# EAGLE schematic base_robot (EAGLE 9.6.2)
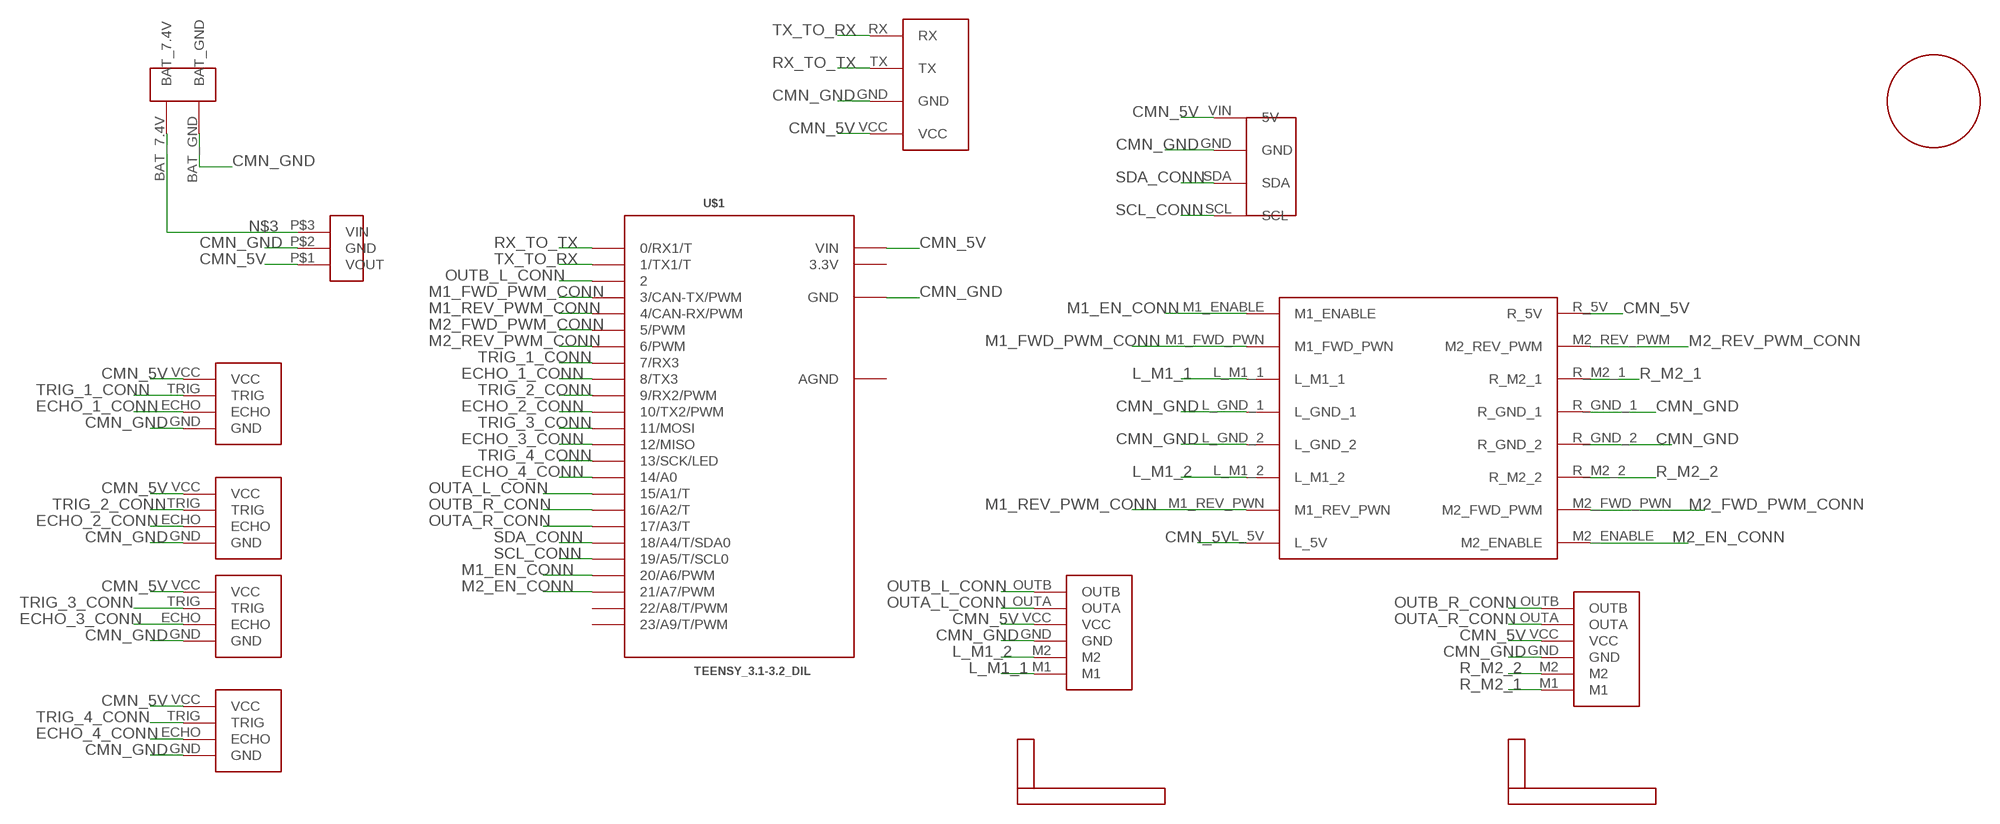
[diagram p0: schematic, sheet 1]

## Parts
U$1  TEENSY_3.1-3.2_DIL  [TEENSY_3.0-3.2&LC_DIL]
U$2  MOTOR_DRIVER  [MOTOR_DRIVER]
U$3  VOLTAGE_REGULATOR  [VOLTAGE_REGULATOR]
U$4  SONAR_SENSOR  [SONAR_SENSOR]
U$5  SONAR_SENSOR  [SONAR_SENSOR]
U$6  SONAR_SENSOR  [SONAR_SENSOR]
U$7  SONAR_SENSOR  [SONAR_SENSOR]
U$8  BATTERY_INPUT  [BATTERY_INPUT]
U$9  MOTOR_ENCODER_25D  [MOTOR_ENCODER_25D]
U$10  MOTOR_ENCODER_25D  [MOTOR_ENCODER_25D]
U$11  IMU  [IMU]
U$12  HC05_BLUETOOTH  [HC05_BLUETOOTH]
U$13  3_4_BALLCASTER  [3_4_BALLCASTER]
U$14  MOTOR_BRACKET_25D  [MOTOR_BRACKET_25D]
U$15  MOTOR_BRACKET_25D  [MOTOR_BRACKET_25D]

## Nets
CMN_5V: U$1.VIN U$2.L_5V U$2.R_5V U$3.P$1(VOUT) U$4.VCC U$5.VCC U$6.VCC U$7.VCC U$9.VCC U$10.VCC U$11.VIN(5V) U$12.VCC
CMN_GND: U$1.GND U$2.L_GND_1 U$2.L_GND_2 U$2.R_GND_1 U$2.R_GND_2 U$3.P$2(GND) U$4.GND U$5.GND U$6.GND U$7.GND U$8.BAT_GND U$9.GND U$10.GND U$11.GND U$12.GND
ECHO_1_CONN: U$1.8(8/TX3) U$4.ECHO
ECHO_2_CONN: U$1.10(10/TX2/PWM) U$5.ECHO
ECHO_3_CONN: U$1.12(12/MISO) U$6.ECHO
ECHO_4_CONN: U$1.14/A0 U$7.ECHO
L_M1_1: U$2.L_M1_1 U$9.M1
L_M1_2: U$2.L_M1_2 U$9.M2
M1_EN_CONN: U$1.20/A6(20/A6/PWM) U$2.M1_ENABLE
M1_FWD_PWM_CONN: U$1.3(3/CAN-TX/PWM) U$2.M1_FWD_PWN
M1_REV_PWM_CONN: U$1.4(4/CAN-RX/PWM) U$2.M1_REV_PWN
M2_EN_CONN: U$1.21/A7(21/A7/PWM) U$2.M2_ENABLE
M2_FWD_PWM_CONN: U$1.5(5/PWM) U$2.M2_FWD_PWN(M2_FWD_PWM)
M2_REV_PWM_CONN: U$1.6(6/PWM) U$2.M2_REV_PWM
N$3: U$3.P$3(VIN) U$8.BAT_7.4V
OUTA_L_CONN: U$1.15/A1(15/A1/T) U$9.OUTA
OUTA_R_CONN: U$1.17/A3(17/A3/T) U$10.OUTA
OUTB_L_CONN: U$1.2 U$9.OUTB
OUTB_R_CONN: U$1.16/A2(16/A2/T) U$10.OUTB
R_M2_1: U$2.R_M2_1 U$10.M1
R_M2_2: U$2.R_M2_2 U$10.M2
RX_TO_TX: U$1.0(0/RX1/T) U$12.TX
SCL_CONN: U$1.19/A5(19/A5/T/SCL0) U$11.SCL
SDA_CONN: U$1.18/A4(18/A4/T/SDA0) U$11.SDA
TRIG_1_CONN: U$1.7(7/RX3) U$4.TRIG
TRIG_2_CONN: U$1.9(9/RX2/PWM) U$5.TRIG
TRIG_3_CONN: U$1.11(11/MOSI) U$6.TRIG
TRIG_4_CONN: U$1.13(13/SCK/LED) U$7.TRIG
TX_TO_RX: U$1.1(1/TX1/T) U$12.RX
Unconnected: U$1.22/A8(22/A8/T/PWM) U$1.23/A9(23/A9/T/PWM)

## Power pins joined to a net without a drawn wire
3.3V: U$1.3.3V
AGND: U$1.AGND

## Library data of the parts
U$1 = Teensy_3_and_LC_Series_Boards_v1.4:TEENSY_3.1-3.2_DIL: Teensy 3.1 or 3.2 in a DIL Layout.
U$2 = motor_driver:MOTOR_DRIVER
U$3 = VOLTAGE_REGULATOR:VOLTAGE_REGULATOR
U$4-U$7 = SONAR_SENSOR:SONAR_SENSOR
U$8 = Battery_input:BATTERY_INPUT
U$9 U$10 = MOTOR_ENCODER_25D:MOTOR_ENCODER_25D
U$11 = IMU:IMU
U$12 = HC05_BLUETOOTH:HC05_BLUETOOTH
U$13 = 3_4_BALLCASTER:3_4_BALLCASTER
U$14 U$15 = MOTOR_BRACKET_25D:MOTOR_BRACKET_25D